# Altium project TouchPanel-I2C-2CH.PrjPcb
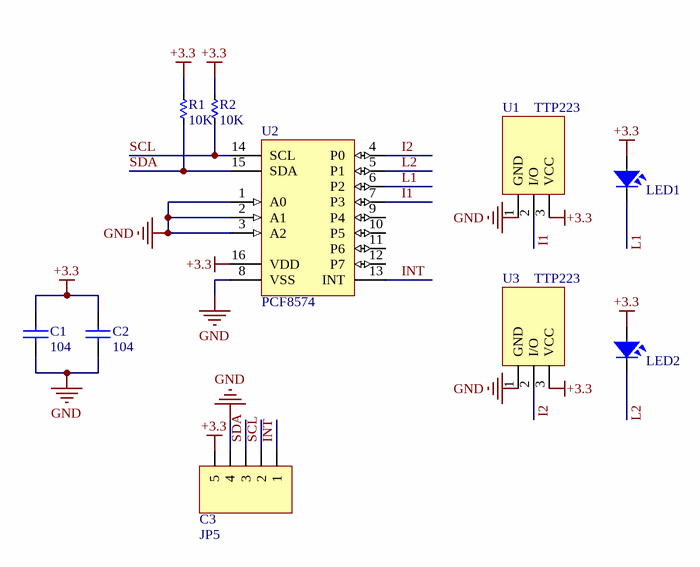
[diagram p0: Sch.SchDoc]
1 sheet, 10 parts. Net scope: global (net labels, ports and power ports of the same name join across sheets).
Board file: PCB-1layer.PcbDoc

## Sheet Sch.SchDoc: Touch Panel I2C 2CH
size A4; Author: nht; DrawnBy: nht; Revision: v1.0; SheetNumber: 1; SheetTotal: 1

### Parts
C1  104  [tu 0805]
C2  104  [tu 0805]
C3  JP5  [JP5-SMD-2.54]
LED1  LED  [LED-5-RED]  (value not drawn)
LED2  LED  [LED-5-RED]  (value not drawn)
R1  10K  [RES-1/4W]
R2  10K  [RES-1/4W]
U1  TTP223  [Module TTP223]
U2  PCF8574  [DIP16]
U3  TTP223  [Module TTP223]

### Nets
+3.3: C1.1 C2.1 C3.5 LED1.1 LED2.1 R1.1 R2.1 U1.3(VCC) U2.16(VDD) U3.3(VCC)
GND: C1.2 C2.2 C3.4 U1.1(GND) U2.1(A0) U2.2(A1) U2.3(A2) U2.8(VSS) U3.1(GND)
I1: U1.2(I/O) U2.7(P3)
I2: U2.4(P0) U3.2(I/O)
INT: C3.1 U2.13(INT)
L1: LED1.2 U2.6(P2)
L2: LED2.2 U2.5(P1)
SCL: C3.2 R2.2 U2.14(SCL)
SDA: C3.3 R1.2 U2.15(SDA)

Not connected (* = marked no-connect by the designer): U2 9(P4) 10(P5) 11(P6) 12(P7)

### Library data of the parts
C1 C2 = Tu 0805 104 50V 10%: Dán; Don_Vi: Con; So_Chan: 2; Ten_Linh_Kien: Tụ 0805 104-100nF 10% 50V; Ma_Hang: MH004551; Chung_Loai: Dán; Kieu_Chan: *
C3 = JP5: WR-PHD 2.54 mm Angled Socket Header; Manufacturer: W¨¹rth Elektronik eiSos GmbH; partNo: 613005143121; ComponentLink1 Description: Manufacturer; ComponentLink2 Description: Datasheet; NoPins: 05; Created Date: 29 March 2013; ComponentLink1URL: http://www.we-online.com; ComponentLink2URL: http://katalog.we-online.de/em/datasheet/6130xx143121.pdf; Created by: Karrer Zheng
LED1 LED2 = LED: LED Single colour Green and Red; Value: LED 3 ly Single Colour
R1 R2 = Res: Manufacturer: Generic Components; Class: Passive; SubClass: R; Published: 08/06/2000; Publisher: Altium Hobart Technology Centre
U1 U3 = Module TTP223